# Altium schematic sheet HAT_controller.SchDoc
size A3; Address1: ECE Department; Address2: University of Canterbury; Address3: Christchurch 8041; Address4: New Zealand; Revision: 1; SheetNumber: 1; SheetTotal: 1; ImagePath: C:\Users\Josh\Documents\Altium_design\Templates\uc-logo.png
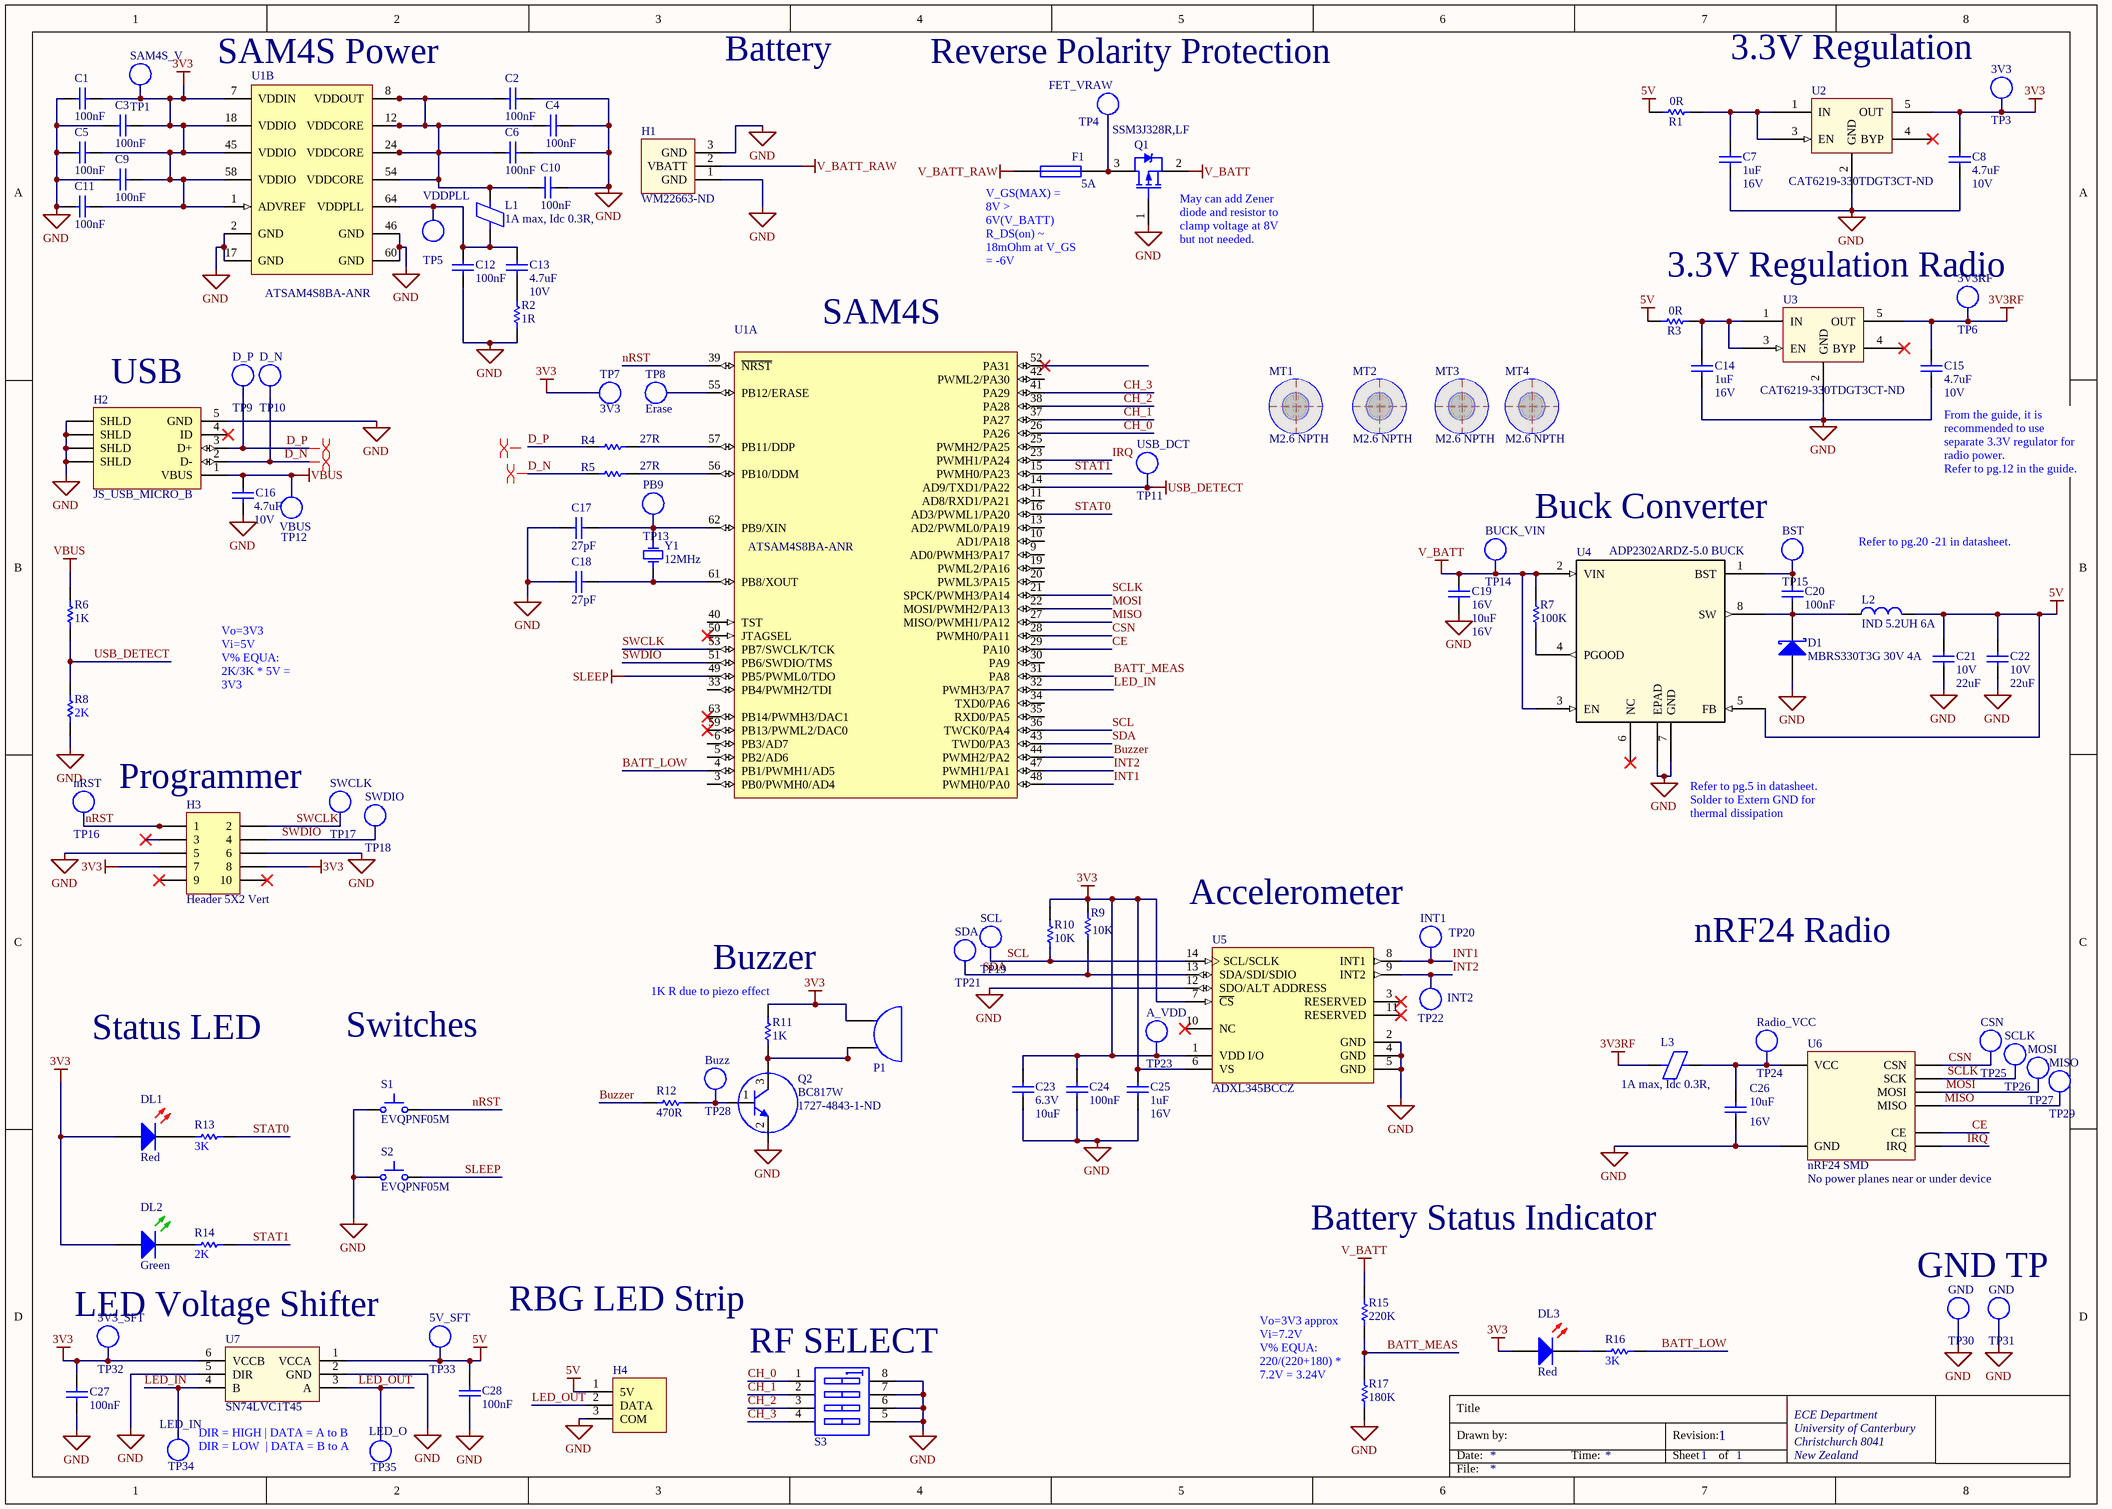
[diagram p0: HAT_controller.SchDoc]

## Parts
C1  100nF  [CAPC1608L]
C2  100nF  [CAPC1608L]
C3  100nF  [CAPC1608L]
C4  100nF  [CAPC1608L]
C5  100nF  [CAPC1608L]
C6  100nF  [CAPC1608L]
C7  Max Voltage: 16V  [CAPC1608L]  (hidden comment: 1uF)
C8  Max Voltage: 10V  [CAPC1608N]  (hidden comment: 4.7uF)
C9  100nF  [CAPC1608L]
C10  100nF  [CAPC1608L]
C11  100nF  [CAPC1608L]
C12  100nF  [CAPC1608L]
C13  Max Voltage: 10V  [CAPC1608N]  (hidden comment: 4.7uF)
C14  Max Voltage: 16V  [CAPC1608L]  (hidden comment: 1uF)
C15  Max Voltage: 10V  [CAPC1608N]  (hidden comment: 4.7uF)
C16  Max Voltage: 10V  [CAPC1608N]  (hidden comment: 4.7uF)
C17  27pF  [CAPC1608L]
C18  27pF  [CAPC1608L]
C19  Voltage - Rated: 16V  [CAPC2012L]  (hidden comment: 10uF)
C20  100nF  [CAPC1608L]
C21  Max Voltage: 10V  [CAPC3216L]  (hidden comment: 22uF)
C22  Max Voltage: 10V  [CAPC3216L]  (hidden comment: 22uF)
C23  Voltage - Rated: 6.3V  [CAPC1608L]  (hidden comment: 10uF)
C24  100nF  [CAPC1608L]
C25  Max Voltage: 16V  [CAPC1608L]  (hidden comment: 1uF)
C26  Voltage - Rated: 16V  [CAPC2012L]  (hidden comment: 10uF)
C27  100nF  [CAPC1608L]
C28  100nF  [CAPC1608L]
D1  MBRS330T3G 30V 4A  [SMC]
DL1  Red  [WL-SMCW0603]
DL2  Green  [WL-SMCW0603]
DL3  Red  [WL-SMCW0603]
F1  5A  [RESC3216N]
H1  Supplier Part Number 1: WM22663-ND  [BATT_HEADER_3POS]  (hidden comment: Battery_HEADER_3pin)
H2  JS_USB_MICRO_B  [FCI_USB_10118194-0001LF]
H3  Header 5X2 Vert  [IDC2.54-V10D]
H4  3 Pin Molex KK Hdr  [MOLEX_KK_3_HDR]  (value not drawn)
L1  1A max, Idc 0.3R,  [INDC3216L]
L2  IND 5.2UH 6A  [INDUCTOR5u2]
L3  1A max, Idc 0.3R,  [INDC3216L]
MT1  M2.6 NPTH  [MNT-HOLE_2.6mm_NPTH]  (no BOM)
MT2  M2.6 NPTH  [MNT-HOLE_2.6mm_NPTH]  (no BOM)
MT3  M2.6 NPTH  [MNT-HOLE_2.6mm_NPTH]  (no BOM)
MT4  M2.6 NPTH  [MNT-HOLE_2.6mm_NPTH]  (no BOM)
P1  Piezo Buzzer  [BUZZER]  (value not drawn)
Q1  SSM3J328R,LF  [SOT23_L]
Q2  Supplier Part Number 2: 1727-4843-1-ND  [SOT323_M]  (hidden comment: BC817W)
R1  0R  [RESC1608L]
R2  1R  [RESC3216L]
R3  0R  [RESC1608L]
R4  27R  [RESC1608L]
R5  27R  [RESC1608L]
R6  1K  [RESC1608L]
R7  100K  [RESC1608L]
R8  2K  [RESC1608L]
R9  10K  [RESC1608L]
R10  10K  [RESC1608L]
R11  1K  [RESC1608L]
R12  470R  [RESC1608L]
R13  3K  [RESC1608L]
R14  2K  [RESC1608L]
R15  220K  [RESC1608L]
R16  3K  [RESC1608L]
R17  value 180K  [RESC1608L]
S1  EVQPNF05M  [EVQPNF05M]
S2  EVQPNF05M  [EVQPNF05M]
S3  WS_SW DIP-4  [DIP_SW_4WAY_SMD -]  (value not drawn)
TP1  SAM4S_V  [TP_0603]
TP3  3V3  [TP_0603]
TP4  FET_VRAW  [TP_0603]
TP5  VDDPLL  [TP_0603]
TP6  3V3RF  [TP_0603]
TP7  3V3  [TP_0603]
TP8  Erase  [TP_0603]
TP9  D_P  [TP_0603]
TP10  D_N  [TP_0603]
TP11  USB_DCT  [TP_0603]
TP12  VBUS  [TP_0603]
TP13  PB9  [TP_0603]
TP14  BUCK_VIN  [TP_0603]
TP15  BST  [TP_0603]
TP16  nRST  [TP_0603]
TP17  SWCLK  [TP_0603]
TP18  SWDIO  [TP_0603]
TP19  SCL  [TP_0603]
TP20  INT1  [TP_0603]
TP21  SDA  [TP_0603]
TP22  INT2  [TP_0603]
TP23  A_VDD  [TP_0603]
TP24  Radio_VCC  [TP_0603]
TP25  CSN  [TP_0603]
TP26  SCLK  [TP_0603]
TP27  MOSI  [TP_0603]
TP28  Buzz  [TP_0603]
TP29  MISO  [TP_0603]
TP30  GND  [TP_0603]
TP31  GND  [TP_0603]
TP32  3V3_SFT  [TP_0603]
TP33  5V_SFT  [TP_0603]
TP34  LED_IN  [TP_0603]
TP35  LED_O  [TP_0603]
U1  ATSAM4S8BA-ANR  [LQFP64_L]  (parts A,B of 2)
U2  Supplier Part Number: CAT6219-330TDGT3CT-ND  [SOT95P280X145-5N]  (hidden comment: CAT6219-330TDGT3)
U3  Supplier Part Number: CAT6219-330TDGT3CT-ND  [SOT95P280X145-5N]  (hidden comment: CAT6219-330TDGT3)
U4  ADP2302ARDZ-5.0 BUCK  [RD_8_1]
U5  ADXL345BCCZ  [ADI-CC-14-1_V]
U6  nRF24 SMD  Warning: No power planes near or under device  [NRF24]
U7  SN74LVC1T45  [SOT23-6_N]
Y1  12MHz  [6.0X3.5-4]

## Nets
3V3: C1.2 C3.2 C5.2 C8.1 C9.2 C11.2 C23.2 C24.2 C25.1 C27.2 DL1.2(A) DL2.2(A) DL3.2(A) H3.7 H3.8 P1.1 R9.2 R10.2 R11.1 TP1.1(TP) TP3.1(TP) TP7.1(TP) TP23.1(TP) TP32.1(TP) U1.1(ADVREF) U1.7(VDDIN) U1.18(VDDIO) U1.45(VDDIO) U1.58(VDDIO) U2.5(OUT) U5.1(VDD_I/O) U5.6(VS) U5.7(~{CS}) U7.6(VCCB)
3V3RF: C15.1 L3.2 TP6.1(TP) U3.5(OUT)
5V: C21.2 C22.2 C28.2 H4.1(5V) L2.2 R1.1 R3.1 TP33.1(TP) U4.5(FB) U7.1(VCCA)
GND: C1.1 C2.1 C3.1 C4.1 C5.1 C6.1 C7.2 C8.2 C9.1 C10.1 C11.1 C12.2 C14.2 C15.2 C16.2 C17.1 C18.1 C19.2 C21.1 C22.1 C23.1 C24.1 C25.2 C26.2 C27.1 C28.1 D1.1(A) H1.1(GND) H1.3(GND) H2.5(GND) H2.6(SHLD) H3.5 H3.6 H4.3(COM) Q1.1 Q2.2 R2.2 R8.2 R17.2 S1.1 S2.1 S3.5(B4) S3.6(B3) S3.7(B2) S3.8(B1) TP30.1(TP) TP31.1(TP) U1.2(GND) U1.17(GND) U1.46(GND) U1.60(GND) U2.2(GND) U3.2(GND) U4.7(GND) U4.EPAD U5.2(GND) U5.4(GND) U5.5(GND) U5.12(SDO/ALT_ADDRESS) U6.2(GND) U7.2(GND) U7.5(DIR)
SLEEP: S2.2 U1.49(PB5/PWML0/TDO)
USB_DETECT: R6.2 R8.1 TP11.1(TP) U1.14(AD9/TXD1/PA22)
V_BATT: C19.1 Q1.2 R7.1 R15.2 TP14.1(TP) U4.2(VIN) U4.3(EN)
V_BATT_RAW: F1.1 H1.2(VBATT)
VBUS: C16.1 H2.1(VBUS) R6.1 TP12.1(TP)
BATT_LOW: R16.2 U1.4(PB1/PWMH1/AD5)
BATT_MEAS: R15.1 R17.1 U1.31(PA8)
Buzzer: R12.1 U1.44(PWMH2/PA2)
CE: U1.29(PA10) U6.3(CE)
CH_0: S3.1(A1) U1.26(PA26)
CH_1: S3.2(A2) U1.37(PA27)
CH_2: S3.3(A3) U1.38(PA28)
CH_3: S3.4(A4) U1.41(PA29)
CSN: TP25.1(TP) U1.28(PWMH0/PA11) U6.4(CSN)
D_N: H2.2(D-) R5.1 TP10.1(TP)
D_P: H2.3(D+) R4.1 TP9.1(TP)
INT1: TP20.1(TP) U1.48(PWMH0/PA0) U5.8(INT1)
INT2: TP22.1(TP) U1.47(PWMH1/PA1) U5.9(INT2)
IRQ: U1.23(PWMH1/PA24) U6.8(IRQ)
LED_IN: TP34.1(TP) U1.32(PWMH3/PA7) U7.4(B)
LED_OUT: H4.2(DATA) TP35.1(TP) U7.3(A)
MISO: TP29.1(TP) U1.27(MISO/PWMH1/PA12) U6.7(MISO)
MOSI: TP27.1(TP) U1.22(MOSI/PWMH2/PA13) U6.6(MOSI)
nRST: H3.1 S1.2 TP16.1(TP) U1.39(~{NRST})
SCL: R10.1 TP19.1(TP) U1.36(TWCK0/PA4) U5.14(SCL/SCLK)
SCLK: TP26.1(TP) U1.21(SPCK/PWMH3/PA14) U6.5(SCK)
SDA: R9.1 TP21.1(TP) U1.43(TWD0/PA3) U5.13(SDA/SDI/SDIO)
STAT0: R13.2 U1.16(AD3/PWML1/PA20)
STAT1: R14.2 U1.15(PWMH0/PA23)
SWCLK: H3.2 TP17.1(TP) U1.53(PB7/SWCLK/TCK)
SWDIO: H3.4 TP18.1(TP) U1.51(PB6/SWDIO/TMS)
NetC2_2: C2.2 C4.2 C6.2 C10.2 L1.2 U1.8(VDDOUT) U1.12(VDDCORE) U1.24(VDDCORE) U1.54(VDDCORE)
NetC7_1: C7.1 R1.2 U2.1(IN) U2.3(EN)
NetC12_1: C12.1 C13.1 L1.1 TP5.1(TP) U1.64(VDDPLL)
NetC13_2: C13.2 R2.1
NetC14_1: C14.1 R3.2 U3.1(IN) U3.3(EN)
NetC17_2: C17.2 TP13.1(TP) U1.62(PB9/XIN) Y1.1(OSC1)
NetC18_2: C18.2 U1.61(PB8/XOUT) Y1.3(OSC2)
NetC20_1: C20.1 D1.2(K) L2.1 U4.8(SW)
NetC20_2: C20.2 TP15.1(TP) U4.1(BST)
NetC26_1: C26.1 L3.1 TP24.1(TP) U6.1(VCC)
NetDL1_1: DL1.1(K) R13.1
NetDL2_1: DL2.1(K) R14.1
NetDL3_1: DL3.1(K) R16.1
NetF1_2: F1.2 Q1.3 TP4.1(TP)
NetP1_2: P1.2 Q2.3 R11.2
NetQ2_1: Q2.1 R12.2 TP28.1(TP)
NetR4_2: R4.2 U1.57(PB11/DDP)
NetR5_2: R5.2 U1.56(PB10/DDM)
NetR7_2: R7.2 U4.4(PGOOD)
NetTP8_1: TP8.1(TP) U1.55(PB12/ERASE)

Not connected (* = marked no-connect by the designer): H2 4(ID)*; H3 3* 9* 10*; U1 3(PB0/PWMH0/AD4) 5(PB2/AD6) 6(PB3/AD7) 9(AD0/PWMH3/PA17) 10(AD1/PA18) 11(AD8/RXD1/PA21) 13(AD2/PWML0/PA19) 19(PWML2/PA16) 20(PWML3/PA15) 25(PWMH2/PA25) 30(PA9) 33(PB4/PWMH2/TDI) 34(TXD0/PA6) 35(RXD0/PA5) 40(TST) 42(PWML2/PA30) 50(JTAGSEL)* 52(PA31)* 59(PB13/PWML2/DAC0)* 63(PB14/PWMH3/DAC1)*; U2 4(BYP)*; U3 4(BYP)*; U4 6(NC)*; U5 3(RESERVED)* 10(NC)* 11(RESERVED)*

## Layout directives
differential pair: (no net found under the mark), D_N, D_P

## Notes on the sheet
- (near U1) SAM4S Power
- Battery
- (near TP4) Reverse Polarity Protection
- 3.3V Regulation
- (near F1) V_GS(MAX) = 8V > 6V(V_BATT)
  R_DS(on) ~ 18mOhm at V_GS = -6V
- (near Q1) May can add Zener diode and resistor to clamp voltage at 8V but not needed.
- 3.3V Regulation Radio
- (near U1) SAM4S
- (near H2) USB
- (near C15) From the guide, it is recommended to use separate 3.3V regulator for radio power.
  Refer to pg.12 in the guide.
- Buck Converter
- Refer to pg.20 -21 in datasheet.
- Vo=3V3
  Vi=5V
  V% EQUA:
  2K/3K * 5V = 3V3
- Programmer
- Refer to pg.5 in datasheet.
  Solder to Extern GND for thermal dissipation
- Accelerometer
- (near R11) Buzzer
- nRF24 Radio
- Status LED
- Switches
- (near R11) 1K R due to piezo effect
- Battery Status Indicator
- LED Voltage Shifter
- RBG LED Strip
- GND TP
- (near S3) RF SELECT
- Vo=3V3 approx
  Vi=7.2V
  V% EQUA:
  220/(220+180) * 7.2V = 3.24V
- DIR = HIGH | DATA = A to B
  DIR = LOW  | DATA = B to A
- Title
- Drawn by:
- Date:
- Time:
- Revision:
- Sheet
- of
- File:

## Library data of the parts
C1-C6 C9-C12 C20 C24 C27 C28 = CC_100nF_0603: CAP CER 100nF X7R +-10% 50V 0603; PackageReference: 0603; Code_IPC: 1608 [0603]; Verify: *; Supplier: ECE Dept; Storage Location: PCB Assembly WS; Value: 100nF
C7 C14 C25 = CC_1uF_0603: CAP CER 1uF Y5V -20% +80% 16V 0603; PackageReference: 0603; Code_IPC: 1608 [0603]; Verify: *; Supplier: ECE Dept; Storage Location: PCB Assembly WS; Value: 1uF
C8 C13 C15 C16 = CC_4.7uF_0603: CAP CER 4.7uF X5R +-20%  10V 0603; Note: Footprint corresponds to dimensions for bulk cassette packaging. This case size has tightened tolerances.; PackageReference: 0805; Code_IPC: 2012[0805]; Verify: *; Supplier: ECE Dept; Storage Location: PCB Assembly WS; Value: 4.7uF
C17 C18 = CC_27pF_0603: CAP CER 27pF NPO/COG +-5% 50V 0603; PackageReference: 0603; Code_IPC: 1608 [0603]; Verify: *; Supplier: ECE Dept; Storage Location: PCB Assembly WS; Value: 27pF
C19 C26 = CC_10uF_0805_16V: CAP CER 10uF X5R 16V 0805; Manufacturer: Samsung Electro-Mechanics; Manufacturer Part Number: CL21A106KOQNNWE; Note: Footprint corresponds to dimensions for bulk cassette packaging. This case size has tightened tolerances.; Tolerance: ±10%; Notification: Current market demand for these product types have resulted in fluctuating and extending lead times. Lead times may differ.; PackageReference: 0805; Code_IPC: 2012[0805]; Supplier 1: Digi-Key; RoHS: RoHS Compliant; Category: Capacitors; Stock 1: 20000; Pricing 1: 1=0.35, 10=0.25, 100=0.1178, 500=0.08254, 1000=0.06831 (NZD); Packaging: Cut Tape (CT); Part Status: Active; Temperature Coefficient: X5R; Operating Temperature: -55°C ~ 85°C; Features: -; Ratings: -; Applications: General Purpose; Mounting Type: Surface Mount, MLCC; Package / Case: 0805 (2012 Metric); Size / Dimension: 0.079" L x 0.049" W (2.00mm x 1.25mm); Height - Seated (Max): -; Thickness (Max): 0.055" (1.40mm); Lead Spacing: -; Lead Style: -; ComponentLink1URL: http://www.samsungsem.com/kr/support/product-search/mlcc/CL21A106KOQNNWE.jsp; ComponentLink1Description: http://www.samsungsem.com/kr/support/product-search/mlcc/CL21A106KOQNNWE.jsp; Supplier Part Number 1: 1276-2894-1-ND; Value: 10uF
  C19: Max Voltage: 16V
C21 C22 = CC_22uF_1206: CAP CER 22uF Y5V -20% +80% 10V 1206; Verify: *; Supplier: ECE Dept; Storage Location: PCB Assembly WS; Dielectric: Y5V; Footprint: 1206 (3216 metric); Value: 22uF
C23 = CC_10uF_0603: CAP CER 10UF X5R +-20% 6V3 0603; Supplier: ECE Dept; Storage Location: PCB Assembly WS; Value: 10uF
D1 = MBRS330T3G: SCHOTTKY  30V 4A; Manufacturer: ON Semiconductor; Speed: Fast Recovery =< 500ns, > 200mA (Io); Supplier 1: Digi-Key; Manufacturer Part Number: MBRS330T3G; RoHS: RoHS Compliant; Category: Discrete Semiconductor Products; Stock 1: 8919; Pricing 1: 1=0.93, 10=0.79, 100=0.5902, 500=0.46368, 1000=0.35829 (NZD); Packaging: Cut Tape (CT); Part Status: Active; Diode Type: Schottky; Current - Average Rectified (Io): 4A; Capacitance @ Vr, F: -; Mounting Type: Surface Mount; Package / Case: DO-214AB, SMC; Supplier Device Package: SMC; Operating Temperature - Junction: -65°C ~ 150°C; Base Part Number: MBRS330; ComponentLink1URL: http://www.onsemi.com/pub/Collateral/MBRS340T3-D.PDF; ComponentLink1Description: http://www.onsemi.com/pub/Collateral/MBRS340T3-D.PDF; Supplier Part Number 1: MBRS330T3GOSCT-ND
DL1 DL3 = DL_150060RS75000: LED Red 250mcd 0603 SMD; Manufacturer: WURTH ELEKTRONIK; Forward Current If: 30; Forward Voltage: 2; Lens Shape: Rectangular; Luminous Intensity: 250; Wavelength Typ: 625; Viewing Angle: 140°; LED Mounting: SMD; Supplier 1: Farnell; Supplier Part Number 1: 2322071; Manufacturer Part Number: 150060RS75000; Storage Location: PCB Assembly WS; Supplier: ECE Dept; LED Colour: Red
DL2 = DL_150060GS75000: LED Green 430mcd 0603 SMD; Manufacturer: WURTH ELEKTRONIK; Forward Current If: 30; Wavelength Typ: 520; Forward Voltage: 3.2; Lens Shape: Rectangular; Luminous Intensity: 430; Viewing Angle: 140°; LED Mounting: SMD; Supplier 1: Farnell; Supplier Part Number 1: 2322070; Manufacturer Part Number: 150060GS75000; Storage Location: PCB Assembly WS; Supplier: ECE Dept; LED Colour: Green
F1 = FS_Fuse_5.0A: Fuse 5.0A Fast Acting 1206 SMD; Manufacturer Part Number: C1F5; Manufacturer: Bel TRP; Voltage Rating (AC): 125V; Voltage Rating (DC): 63V; DC Cold Resistance: 19mR; Fuse Type: Board Mount (Cartridge Style Excluded); Approvals: CE,cURus; Mount: Surface Mount; Case/Package: 1206; Number of Pins: 2; Case Code (Metric): 3216; Case Code (Imperial): 1206; Contact Plating: Nickel,Tin; Min Operating Temperature: -55°C; Max Operating Temperature: 125°C; Packaging: Tape and Reel; Voltage Rating: 125V; Length: 0.126inch; Width: 0.062inch; Supplier 1: Digi-Key; Stock 1: 725; Pricing 1: 1=0.32, 5=0.312, 10=0.298, 50=0.2662, 100=0.2479, 250=0.22032, 500=0.1836, 1000=0.17442 (USD); ComponentLink1URL: http://www.farnell.com/datasheets/2571625.pdf; ComponentLink1Description: http://www.farnell.com/datasheets/2571625.pdf; ComponentLink2URL: http://belfuse.com/pdfs/C1F.pdf; ComponentLink2Description: http://belfuse.com/pdfs/C1F.pdf; ComponentLink3URL: http://www.mouser.com/ds/2/643/C1F-594910.pdf; ComponentLink3Description: http://www.mouser.com/ds/2/643/C1F-594910.pdf; ComponentLink4URL: https://belfuse.com/resources/StewartConnector/C1F.pdf; ComponentLink4Description: https://belfuse.com/resources/StewartConnector/C1F.pdf; Current Rating: 5A; Supplier Part Number 1: 507-1886-1-ND; Supplier 2: Element14; Supplier Part Number 2: 2848595; Value: 5A
H1 = Battery_HEADER_3pin: 3Pin Header 2.54mm spacing / Digikey #WM22663-ND; Supplier 1: Digi-Key
H2 = JS_USB_MICRO_B_SMT: CONN USB MICRO B RECPT SMT R/A; Manufacturer: FCI; Manufacturer Part Number: 10118194-0001LF; Gender: Receptacle; Number of Contacts: 5; Specifications: USB 2.0; Supplier 1: Digi-Key; Supplier Part Number 1: 609-4618-1-ND; Features: Shielded, Solder Retention; Mounting Type: Surface Mount, Right Angle, Horizontal
H3 = JA_HDR_IDC_5X2_VERT: IDC Header, 2,54mm, 10-Pin, Vert; Supplier: ECE Dept; Supplier 1: Farnell; Supplier Part Number 1: 1096985; Storage Location: ECE Dept Store
H4 = LED_Strip_Header: CONN HEADER 3POS 2.54mm VERT_Thru Hole; Manufacturer: Molex; Manufacturer PN: 22-23-2031; Supplier Part Number 1: 9731156; Supplier: ECE Dept; Supplier 1: Farnell; Storage Location: ECE Dept Store; Value: 3 Pin Molex KK Hdr
L1 L3 = IN_Ferrite-Bead: Ferrite Bead, Rdc 0.3R, Z100MHZ 600R, Imax 1A, SMD 1206; Manufacturer: FAIR-RITE; Manufacturer PN: 2512066017Y1; DC Current Rating: 1; DC Resistance Max: 0.08; Ferrite Case Style: 1206 ^3216 Metric]; Frequency Range: 50MHz to 1; Impedance: 600; Impedance Tolerance: ± 25%; Supplier: ECE Dept; Storage Location: PCB Assembly WS; Ferrite Mounting: SMD; Supplier 1: Farnell; Supplier Part Number 1: 1612060; Manufacturer Part Number: 2512066017Y1; Value: 1A max, Idc 0.3R,
L2 = CDRH104RNP-5R2NC: FIXED IND 5.2UH 6A 22 MOHM SMD; Manufacturer: Sumida America Components Inc.; Material - Core: Ferrite; Tolerance: ±30%; Current - Saturation: 5.6A; Shielding: Shielded; DC Resistance (DCR): 22 mOhm Max; Supplier 1: Digi-Key; Manufacturer Part Number: CDRH104RNP-5R2NC; RoHS: RoHS Compliant; Category: Inductors, Coils, Chokes; Stock 1: 3849; Pricing 1: 1=2.9, 10=2.678, 100=1.8743, 500=1.5173 (NZD); Packaging: Cut Tape (CT); Part Status: Active; Type: -; Q @ Freq: -; Frequency - Self Resonant: -; Ratings: -; Operating Temperature: -40°C ~ 100°C; Mounting Type: Surface Mount; Package / Case: Nonstandard; Supplier Device Package: -; Size / Dimension: 0.402" L x 0.394" W (10.20mm x 10.00mm); Height - Seated (Max): 0.157" (4.00mm); ComponentLink1URL: http://products.sumida.com/products/pdf/CDRH104R.pdf; ComponentLink1Description: http://products.sumida.com/products/pdf/CDRH104R.pdf; Supplier Part Number 1: 308-2280-1-ND
MT1-MT4 = MC_M2.6_HOLE: Fixing M2.6 Mount Hole NPTH; Manufacturer: Hi-Q; Manufacturer PN: 2BV series M2.5 Clearance; price: 0; Supplier: ECE Dept; value: M2.6 NPTH
P1 = Piezo Buzzer: TDK - PS1240P02BT - BUZZER, PIEZO, 70DB, 12.2MM; Number of Terminals/Pins: 2; Frequency: 4kHz; Operating Supply Voltage: 3V; Washable: No; Supplier 1: Digi-Key; Manufacturer 1: TDK; Manufacturer Part Number 1: PS1240P02BT; Stock 1: 24025; Pricing 1: 1=0.61000, 10=0.52500, 25=0.49120, 50=0.46580, 100=0.44110 (USD); RoHS: Yes; Mount: Through Hole; Number of Pins: 2; Min Operating Temperature: -10°C; Max Operating Temperature: 70°C; Package Quantity: 1; Packaging: Tape and Reel; Termination: PC Pins; Voltage Rating (DC): 3V; Series: PS; Diameter: 12.2mm; Height: 6.5mm; Lead Free: Lead Free; RoHS Compliant: Yes; ComponentLink1URL: https://datasheet.ciiva.com/0/ef532-ps-112.pdf?src-supplier=Digi-Key; ComponentLink1Description: https://datasheet.ciiva.com/0/ef532-ps-112.pdf?src-supplier=Digi-Key; ComponentLink2URL: https://datasheet.ciiva.com/0/ef532-ps-111.pdf?src-supplier=Digi-Key; ComponentLink2Description: https://datasheet.ciiva.com/0/ef532-ps-111.pdf?src-supplier=Digi-Key; ComponentLink3URL: https://datasheet.ciiva.com/3306/ef532-ps-3306958.pdf?src-supplier=Avnet; ComponentLink3Description: https://datasheet.ciiva.com/3306/ef532-ps-3306958.pdf?src-supplier=Avnet; ComponentLink4URL: https://datasheet.ciiva.com/16225/ef532-ps-16225062.pdf?src-supplier=Onlinecomponents.com; ComponentLink4Description: https://datasheet.ciiva.com/16225/ef532-ps-16225062.pdf?src-supplier=Onlinecomponents.com; Supplier Part Number 1: 445-2525-1-ND
Q1 = TM_SSM3J328R: MOSFET P-CH 20V 6A SOT23-3; Manufacturer: Toshiba; FET Feature: Logic Level Gate, 1.5V Drive; FET Type: MOSFET P-Channel, Metal Oxide; Gate Charge (Qg) @ Vgs: 12.8nC @ 4.5V; Input Capacitance (Ciss) @ Vds: 840pF @ 10V; Power - Max: 1W; Rds On Max: 29.8mR; Drain to Source Resistance: 47.4mR; Turn-On Delay Time: 32ns; Power Dissipation: 2W; Number of Channels: 1; Turn-Off Delay Time: 107ns; Gate to Source Voltage (Vgs): 8V; Input Capacitance: 840pF; Element Configuration: Single; Drain to Source Breakdown Voltage: -20V; Vgs(th) (Max) @ Id: 1V @ 1mA; Current - Continuous Drain (Id) @ 25° C: 6A; Drain to Source Voltage (Vdss): 20V; Package / Case: SOT-23-3 Flat Leads; Supplier Device Package: SOT-23F; Pricing: 1=0.79, 10=0.658, 25=0.5772, 100=0.4939, 250=0.42836, 500=0.36284, 1000=0.27972 (NZD); Storage Location: PCB Assembly WS; Supplier: Digi-Key; ComponentLink1URL: https://datasheet.ciiva.com/11158/ssm3j328r-datasheet-en-20140301-11158652.pdf; ComponentLink1Description: https://datasheet.ciiva.com/11158/ssm3j328r-datasheet-en-20140301-11158652.pdf; Supplier Part Number: SSM3J328RLFDKR-ND; Max Operating Temperature: 150°C; Mount: Surface Mount; Packaging: Tape and Reel; Min Operating Temperature: -55°C; Continuous Drain Current (ID): 6A; Radiation Hardening: No; Max Power Dissipation: 1W; Package Quantity: 3000; Case/Package: SOT-23-3; Number of Pins: 3; Number of Elements: 1; Supplier 1: Digi-Key; Supplier Part Number 1: SSM3J328RLFDKR-ND; Manufacturer Part Number: SSM3J328R,LF
Q2 = TB_BC817W: NPN GP Bipolar Transistor 45V 500mA SOT323; Manufacturer: NXP; Supplier 1: Farnell; Supplier Part Number 1: 2114873; Manufacturer PN: BC817W; Storage Location: PCB Assembly WS; Supplier: ECE Dept; Supplier 2: Digi-Key; Value: BC817W
R1 R3 = RS_0R0: RES 0.0 OHM 1/10W 5% 0603 SMD; Storage Location: PCB Assembly WS; Supplier: ECE Dept; Value: 0R
R2 = RT_1R: RES 1R OHM 1/4W 5% 1206 SMD; Storage Location: PCB Assembly WS; Supplier: ECE Dept; Value: 1R
R4 R5 = RS_27R: RES 27 OHM 1/10W 5% 0603 SMD; Storage Location: PCB Assembly WS; Supplier: ECE Dept; Value: 27R
R6 R11 = RS_1K: RES 1.0K OHM 1/10W 5% 0603 SMD; Storage Location: PCB Assembly WS; Supplier: ECE Dept; Value: 1K
R7 = RS_100K: RES 100K OHM 1/10W 5% 0603 SMD; Storage Location: PCB Assembly WS; Supplier: ECE Dept; Value: 100K
R8 R14 = RS_2K: RES 2K OHM 1/10W 5% 0603 SMD; Storage Location: PCB Assembly WS; Supplier: ECE Dept; Value: 2K
R9 R10 = RS_10K: RES 10.0K OHM 1/10W 5% 0603 SMD; Storage Location: PCB Assembly WS; Supplier: ECE Dept; Value: 10K
R12 = RS_470R: RES 470 OHM 1/10W 5% 0603 SMD; Storage Location: PCB Assembly WS; Supplier: ECE Dept; Value: 470R
R13 R16 = RS_3K: RES 3K OHM 1/10W 5% 0603 SMD; Storage Location: PCB Assembly WS; Supplier: ECE Dept; Value: 3K
R15 = RS_220K: RES 3.3K OHM 1/10W 5% 0603 SMD; Storage Location: PCB Assembly WS; Supplier: ECE Dept; Value: 220K
R17 = RS_180K: RES 180K OHM 1/10W 5% 0603 SMD; Storage Location: PCB Assembly WS; Supplier: ECE Dept
S1 S2 = WS_EVQPNF05M: Panasonic 6 x 3.5mm SMD Light Touch Switch Type SMD; PackageDescription: 6.0 x 3.5 mm; Supplier 1: Farnell; Supplier Part Number 1: 2079481; Manufacturer: Panasonic; Manufacturer PN: EVQPNF05M; Supplier 2: Digi-Key; Supplier Part Number 2: P13598SCT-ND; Storage Location: PCB Assembly WS; Supplier: ECE Dept
S3 = WS_SW DIP-4: DIP Switch, 4 Position, SPST SMD; Manufacturer: OMRON ELECTRONIC COMPONENTS; Manufacturer Part Number: A6SN-4101; Contact Current DC Max: 25; External Length / Height: 12.1; No. of Switch Positions: 4; Pitch Spacing: 2.54; Contact Configuration: SPST; Supplier 1: Farnell; Supplier Part Number 1: 2029425; Storage Location: PCB Assembly WS; Supplier: ECE Dept
TP1 TP3-TP35 = TP_0603: Test Point 1.65X0.9X1.2mm SMD; Manufacturer: TE Connectivity AMP Connectors; Manufacturer Part Number: 1625854-3; Supplier 1: Digi-Key; Mounting Type: Surface Mount; Terminal: 0.063" x 0.031" x 0.045" (1.60mm x 0.80mm x 1.15mm); Type: PC Test Point; Supplier Part Number 1: A106145CT-ND
U1 = SE_ATSAM4S16BA-MU: IC MCU 32BIT 512KB FLASH 64LQFP; Manufacturer: Atmel; Connectivity: I²C, IrDA, Memory Card, SPI, SSC, UART/USART, USB; Core Processor: ARM® Cortex®-M4; Core Size: 32-Bit; Data Converters: A/D 11x12b, D/A 2x12b; Number of I/O: 47; Peripherals: Brown-out Detect/Reset, DMA, POR, PWM, WDT; Program Memory Size: 512KB (512K x 8); RAM Size: 128K x 8; Speed: 120MHz; Voltage - Supply (Vcc/Vdd): 1.62 V ~ 3.6 V; PackageVersion: revJ, Jul-2007; PackageReference: 64PS; PackageDescription: 64-Pin Quad Flat No-Lead (QFN) Sawn, 9 x 9 x 1.0 mm Body, 0.5 mm Pitch, Exposed Pad; Code_JEDEC: MO-220VMMD-3; ComponentLink1Description: Manufacturer URL; ComponentLink1URL: http://www.atmel.com/; ComponentLink2Description: SAM4S Series Datasheet; ComponentLink2URL: http://www.atmel.com/dyn/resources/prod_documents/11100.pdf; ComponentLink3Description: SAM4S Series Summary; ComponentLink3URL: http://www.atmel.com/dyn/resources/prod_documents/11100S.pdf; Supplier 1: Digi-Key; Package / Case: 64-LQFP; Packaging: Cut Tape (CT); Program Memory Type: FLASH; Supplier Part Number 1: ATSAM4S8BA-ANRCT-ND; Manufacturer Part Number: ATSAM4S8BA-ANR
U2 U3 = SV_CAT6219-330TDGT3: IC REG LIN 3.3V 500MA TSOT23-5; Voltage - Input (Max): 5.5V; Voltage Dropout (Max): 0.5V @ 500mA; Manufacturer Part Number: CAT6219-330TDGT3; Base Part Number: CAT6219; Current - Output: 500mA; Package / Case: SOT-23-5 Thin, TSOT-23-5; Supplier: Digi-Key; Supplier Device Package: TSOT-23-5; Voltage - Output (Min/Fixed): 3.3V; ComponentLink1URL: http://www.onsemi.com/pub/Collateral/CAT6219-D.PDF; ComponentLink1Description: http://www.onsemi.com/pub/Collateral/CAT6219-D.PDF; Supplier 1: Digi-Key; ComponentLink2Description: CAT6219 Datasheet; ComponentLink2URL: \\maxwell\elecapp\AltiumDesigner\Libraries\DatasheetsNew\ENCE461\CAT6219-D.PDF
U4 = ADP2302ARDZ-5.0-R7: IC REG BUCK 5V 2A 8SOIC; Vendor: Analog Devices Inc; Frequency - Switching: 700kHz; Output Type: Fixed; Voltage - Input (Max): 20V; Manufacturer_Part_Number: ADP2302ARDZ-5.0-R7; Type: DEV; Value: Value; Supplier 1: Digi-Key; Current - Output: 2A; Voltage - Output (Min/Fixed): 5V; Supplier Part Number 1: ADP2302ARDZ-5.0-R7CT-ND; ComponentLink1Description: ADP2302ARDZ-5.0 Datasheet; ComponentLink1URL: \\maxwell\elecapp\AltiumDesigner\Libraries\DatasheetsNew\ENCE461\ADP2302_2303.pdf
U5 = ADXL345BCCZ: Accelerometer 3-Axis, +/-2 g / +/-4 g / +/-8 g / +/-16 g with Digital Output, 1.6 KHz BW, Industrial, 14-pin LGA, Tray; Manufacturer: Analog Devices; Sensitivity: 256/128/64/32 LSB/g; Voltage Supply (V): 2.0 to 3.6; Supply Current: 140 uA; # of Axes: 3; -3dB Bandwidth: 1.6 KHz; PackageReference: CC-14-1; ComponentLink1Description: Manufacturer URL; Packing: Tray; ComponentLink4URL: http://www.analog.com/en/mems-sensors/mems-inertial-sensors/adxl345/products/product.html; ComponentLink2URL: http://www.analog.com/static/imported-files/data_sheets/ADXL345.pdf; Mounting Technology: Surface Mount; ComponentLink3URL: http://www.analog.com/static/imported-files/data_sheets/ADXL343.pdf; PartNumber: ADXL345BCCZ; ComponentLink4Description: Product URL; Output Type: Digital; ComponentLink3Description: Package Specification; DatasheetVersion: Rev. D; PackageVersion: 03-16-2010-A, 03/2010; ComponentLink1URL: http://www.analog.com/en/index.html; ComponentLink2Description: Datasheet; PackageDescription: 14-Pin Land Grid Array, 3 x 5 mm Body, 0.8 mm Pitch; Manufacturer 1: Analog Devices; Manufacturer Part Number 1: ADXL345BCCZ
U6 = NRF24: nRF24 SMD Module
U7 = SN74LVC1T45: 1.8V - 5V level converter
Y1 = XT_CRYSTAL_12MHz_18pF: CRYSTAL 12MHZ 18PF 6X3.5mm SMD; Manufacturer: CTS-Frequency Controls; Manufacturer Part Number: 406C35D12M00000; ESR (Equivalent Series Resistance): 60 Ohm; Frequency Stability: ±50ppm; Frequency Tolerance: ±30ppm; Operating Mode: Fundamental; Supplier 1: Digi-Key; Height: 0.047" (1.20mm); Load Capacitance: 18pF; Mounting Type: Surface Mount; Operating Temperature: -20°C ~ 70°C; Package / Case: 4-SMD, No Lead (DFN, LCC); Size / Dimension: 0.236" L x 0.138" W (6.00mm x 3.50mm); Supplier Part Number 1: CTX855CT-ND; Frequency: 12MHz